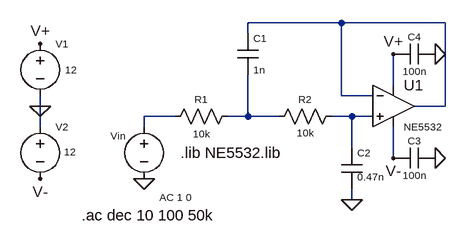
[diagram p0: schematic LPF.asc]
LPF.asc, the LTspice schematic file:
Version 4.1
SHEET 1 880 680
WIRE 304 32 160 32
WIRE 464 32 304 32
WIRE 160 48 160 32
WIRE 384 128 384 80
WIRE 304 144 304 32
WIRE 352 144 304 144
WIRE -160 160 -160 144
WIRE 464 160 464 32
WIRE 464 160 416 160
WIRE 48 176 0 176
WIRE 160 176 160 112
WIRE 160 176 128 176
WIRE 208 176 160 176
WIRE 320 176 288 176
WIRE 352 176 320 176
WIRE -160 192 -160 160
WIRE 0 192 0 176
WIRE 320 224 320 176
WIRE 384 240 384 192
WIRE 320 304 320 288
FLAG -160 64 V+
FLAG 384 80 V+
FLAG 0 272 0
FLAG -160 160 0
FLAG -160 272 V-
FLAG 384 240 V-
FLAG 320 304 0
FLAG 448 80 0
FLAG 448 240 0
SYMBOL res 32 192 R270
WINDOW 0 32 56 VTop 1
WINDOW 3 0 56 VBottom 1
SYMATTR InstName R1
SYMATTR Value 10k
SYMBOL res 192 192 R270
WINDOW 0 32 56 VTop 1
WINDOW 3 1 56 VBottom 1
SYMATTR InstName R2
SYMATTR Value 10k
SYMBOL cap 144 48 R0
WINDOW 0 24 8 Left 1
WINDOW 3 24 56 Left 1
SYMATTR InstName C1
SYMATTR Value 1n
SYMBOL voltage -160 48 R0
WINDOW 0 24 16 Left 1
WINDOW 3 38 56 Left 1
WINDOW 123 0 0 Left 0
WINDOW 39 0 0 Left 0
SYMATTR InstName V1
SYMATTR Value 12
SYMBOL cap 304 224 R0
WINDOW 0 24 8 Left 1
WINDOW 3 24 45 Left 1
SYMATTR InstName C2
SYMATTR Value 0.47n
SYMBOL voltage 0 176 R0
WINDOW 0 -52 30 Left 1
WINDOW 3 24 96 Left 1
WINDOW 123 24 124 Left 1
WINDOW 39 0 0 Left 0
SYMATTR InstName Vin
SYMATTR Value ""
SYMATTR Value2 AC 1 0
SYMBOL voltage -160 176 R0
WINDOW 0 24 16 Left 1
WINDOW 3 37 54 Left 1
WINDOW 123 0 0 Left 0
WINDOW 39 0 0 Left 0
SYMATTR InstName V2
SYMATTR Value 12
SYMBOL OpAmps\\opamp2 384 96 R0
WINDOW 3 16 96 Left 1
SYMATTR InstName U1
SYMATTR Value NE5532
SYMBOL cap 384 256 R270
WINDOW 0 32 32 VTop 1
WINDOW 3 0 32 VBottom 1
SYMATTR InstName C3
SYMATTR Value 100n
SYMBOL cap 448 64 R90
WINDOW 0 0 32 VBottom 1
WINDOW 3 32 32 VTop 1
SYMATTR InstName C4
SYMATTR Value 100n
TEXT -96 328 Left 2 !.ac dec 10 100 50k
TEXT 56 232 Left 2 !.lib NE5532.lib

The netlist it stands for:
* LPF.asc
R1 N002 N003 10k
R2 N003 N004 10k
C1 N001 N003 1n
V1 V+ 0 12
C2 N004 0 0.47n
Vin N002 0 AC 1 0
V2 0 V- 12
X§U1 N004 N001 V+ V- N001 NE5532  ; pins In+ In- V+ V- OUT
C3 V- 0 100n
C4 0 V+ 100n
.ac dec 10 100 50k
.lib NE5532.lib
.backanno
.end